# Altium schematic sheet Sensors.SchDoc
size A
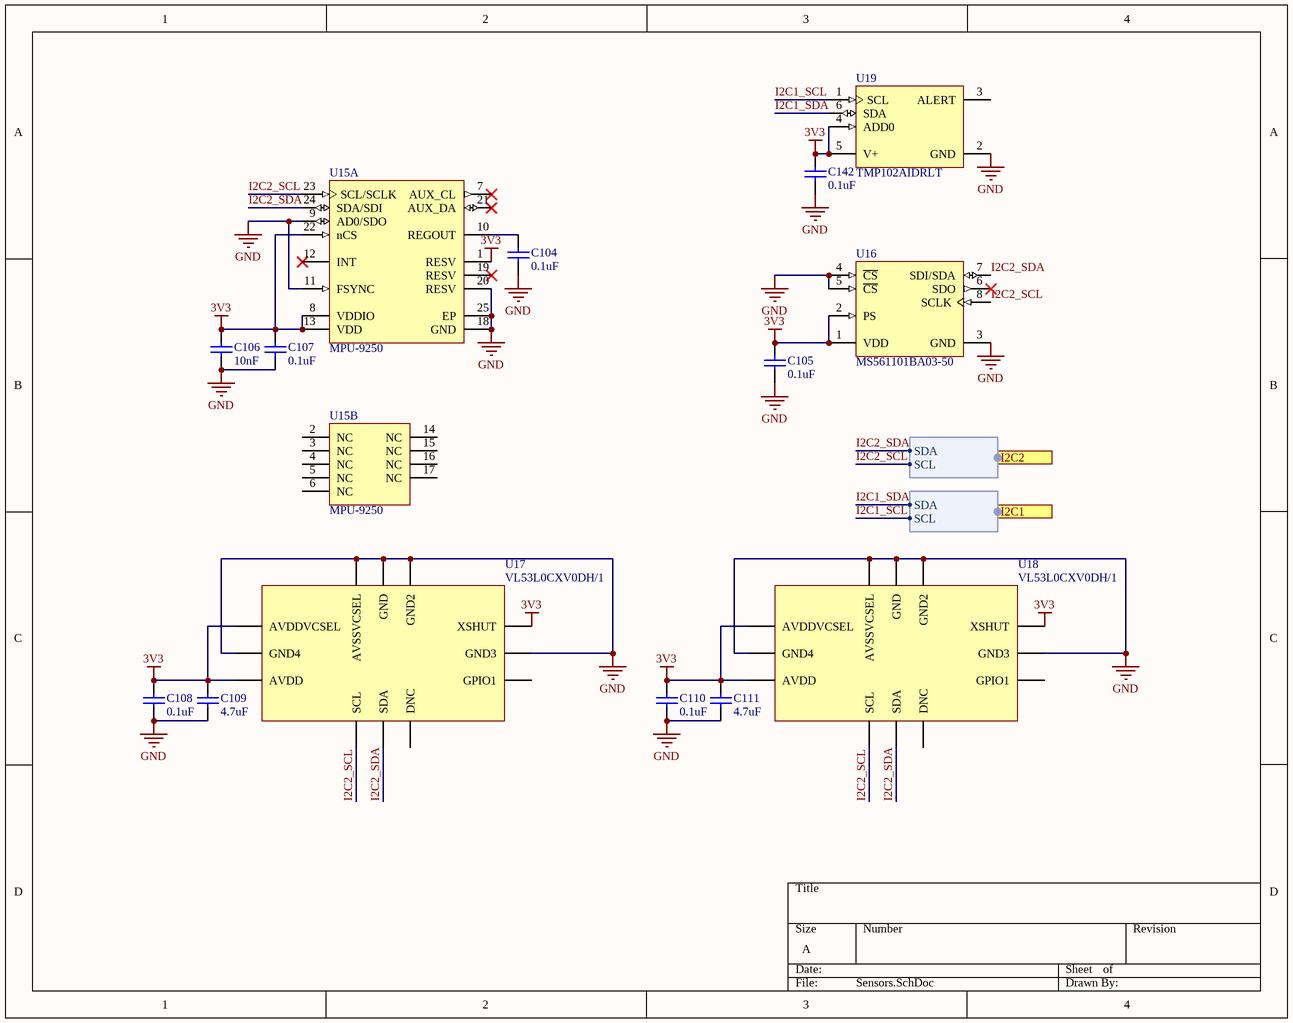
[diagram p0: Sensors.SchDoc]

## Parts
C104  value 0.1uF  [C0402[1005X55]]  (hidden comment: 0.1uF 6.3V 0402)
C105  value 0.1uF  [C0402[1005X55]]  (hidden comment: 0.1uF 6.3V 0402)
C106  value 10nF  [C0402[1005X55]]  (hidden comment: 10nF 50V 0402)
C107  value 0.1uF  [C0402[1005X55]]  (hidden comment: 0.1uF 6.3V 0402)
C108  value 0.1uF  [C0402[1005X55]]  (hidden comment: 0.1uF 6.3V 0402)
C109  value 4.7uF  [C0402[1005X55]]  (hidden comment: 4.7uF 6.3V 0402)
C110  value 0.1uF  [C0402[1005X55]]  (hidden comment: 0.1uF 6.3V 0402)
C111  value 4.7uF  [C0402[1005X55]]  (hidden comment: 4.7uF 6.3V 0402)
C142  value 0.1uF  [C0402[1005X55]]  (hidden comment: 0.1uF 6.3V 0402)
U15  MPU-9250  [QFN-24 (0.4MM)]  (parts A,B of 2)
U16  MS561101BA03-50  [MSI-MS561101BA03-50-8_V]
U17  VL53L0CXV0DH/1  [LGA-12]
U18  VL53L0CXV0DH/1  [LGA-12]
U19  TMP102AIDRLT  [DRL0006A_L]

## Ports
I2C1 (harness I2C), I2C2 (harness I2C)

## Harnesses
I2C: SCL, SDA

## Nets
3V3: C105.2 C106.2 C107.2 C108.2 C109.2 C110.2 C111.2 C142.2 U15.1(RESV) U15.8(VDDIO) U15.13(VDD) U15.22(nCS) U16.1(VDD) U16.2(PS) U17.1(AVDDVCSEL) U17.5(XSHUT) U17.11(AVDD) U18.1(AVDDVCSEL) U18.5(XSHUT) U18.11(AVDD) U19.4(ADD0) U19.5(V+)
GND: C104.1 C105.1 C106.1 C107.1 C108.1 C109.1 C110.1 C111.1 C142.1 U15.9(AD0/SDO) U15.11(FSYNC) U15.18(GND) U15.20(RESV) U15.25(EP) U16.3(GND) U16.4(~{CS}) U16.5(~{CS}) U17.2(AVSSVCSEL) U17.3(GND) U17.4(GND2) U17.6(GND3) U17.12(GND4) U18.2(AVSSVCSEL) U18.3(GND) U18.4(GND2) U18.6(GND3) U18.12(GND4) U19.2(GND)
I2C1_SCL: U19.1(SCL) ; port I2C1.SCL
I2C1_SDA: U19.6(SDA) ; port I2C1.SDA
I2C2_SCL: U15.23(SCL/SCLK) U16.8(SCLK) U17.10(SCL) U18.10(SCL) ; port I2C2.SCL
I2C2_SDA: U15.24(SDA/SDI) U16.7(SDI/SDA) U17.9(SDA) U18.9(SDA) ; port I2C2.SDA
NetC104_2: C104.2 U15.10(REGOUT)

Not connected (* = marked no-connect by the designer): U15 2(NC) 3(NC) 4(NC) 5(NC) 6(NC) 7(AUX_CL)* 12(INT)* 14(NC) 15(NC) 16(NC) 17(NC) 19(RESV)* 21(AUX_DA)*; U16 6(SDO)*; U17 7(GPIO1) 8(DNC); U18 7(GPIO1) 8(DNC); U19 3(ALERT)

## Library data of the parts
C104 C105 C107 C108 C110 C142 = CAP_0.1uF_6.3V_0402_10%: 0.1uF 6.3V 10% 0402 (1005 Metric); PartNumber: GRM155R70J104KA01D; Manufacturer: Murata; Mounting Technology: Surface Mount; PackageReference: 0402; PackageDescription: 0402 (1005 Metric); Voltage: 6.3V; Tolerance: 10%
C106 = CAP_10nF_50V_0402_10%: 10nF 50V 10% 0402 (1005 Metric); PartNumber: GCM155R71H103KA55D; Manufacturer: Murata; Mounting Technology: Surface Mount; PackageReference: 0402; PackageDescription: 0402 (1005 Metric); Voltage: 50V; Tolerance: 10%
C109 C111 = CAP_4.7uF_6.3V_0402_20%: 4.7uF 6.3V 20% 0402 (1005 Metric); PartNumber: GRM155R60J475ME47D; Manufacturer: Murata; Mounting Technology: Surface Mount; PackageReference: 0402; PackageDescription: 0402 (1005 Metric); Voltage: 6.3V; Tolerance: 20%
U15 = MPU-9250: Manufacturer: Invensense; PartNumber: MPU-9250; Mounting Technology: Surface Mount; PackageReference: QFN-24
U16 = CMP-2000-05251-1: Barometric Pressure Sensor, with Stainless Steel Cap, 1.8 to 3.6 V, -45 to 85 degC, 8-Pin QFN, RoHS, Tape and Reel; Manufacturer: Measurement Specialties; Operating Pressure Max: 1200mbar; Supply Current: 12.5µA; Supply Voltage Max: 3.6V; Supply Voltage Min: 1.8V; No. of Pins: 8; Connection Size: 0.5mm; SVHC: NoSVHC(20-Jun-2013); Operating Pressure Min: 10mbar; Manufacturer URL: http://www.meas-spec.com/; Operating Temperature Min: -40degC; Pressure Type: Barometric; Package Reference: MS561101BA03-50-8; Datasheet URL: http://www.te.com/commerce/DocumentDelivery/DDEController?Action=srchrtrv&DocNm=MS5611-01BA03&DocType=Data+Sheet&DocLang=English&DocFormat=pdf&PartCntxt=CAT-BLPS0036; Package Description: 8-Pin Surface Mount Device, Body 5 x 3 mm, Pitch 1.25 mm; Sensor Case Style: QFN; Datasheet Version: Sep-15; Operating Temperature Max: 85degC
U17 U18 = VL53L0CXV0DH/1: Optical Sensor Modules Time-of-Flight (ToF) ranging sensor; Manufacturer: STMicroelectronics; PartNumber: VL53L0CXV0DH/1; Mounting Technology: Surface Mount; PackageReference: LGA-12
U19 = CMP-1685-00013-1: Low Power Digital Temperature Sensor with SMBus and Two-Wire Serial Interface, 1.4 to 3.6 V, -40 to 125 degC, 6-Pin SOT (DRL), Green (RoHS & no Sb/Br), Tape and Reel; ComponentLink3URL: http://www.ti.com/lit/ml/mpds159c/mpds159c.pdf; PackageVersion: 4205622-3/D, 08/2207; ComponentLink2Description: Datasheet; PackageReference: DRL0006A; ComponentLink2URL: http://www.ti.com/lit/ds/symlink/tmp102.pdf; ComponentLink3Description: Package Specification; ComponentLink1Description: Manufacturer URL; DatasheetVersion: SBOS397F, 12/2015; PackageDescription: 6-Pin Plastic Small Outline, Body 1.6 x 1.2 mm, Pitch 0.5 mm; ComponentLink1URL: http://www.ti.com/